# EAGLE design WebServer3 (EAGLE 6.1)
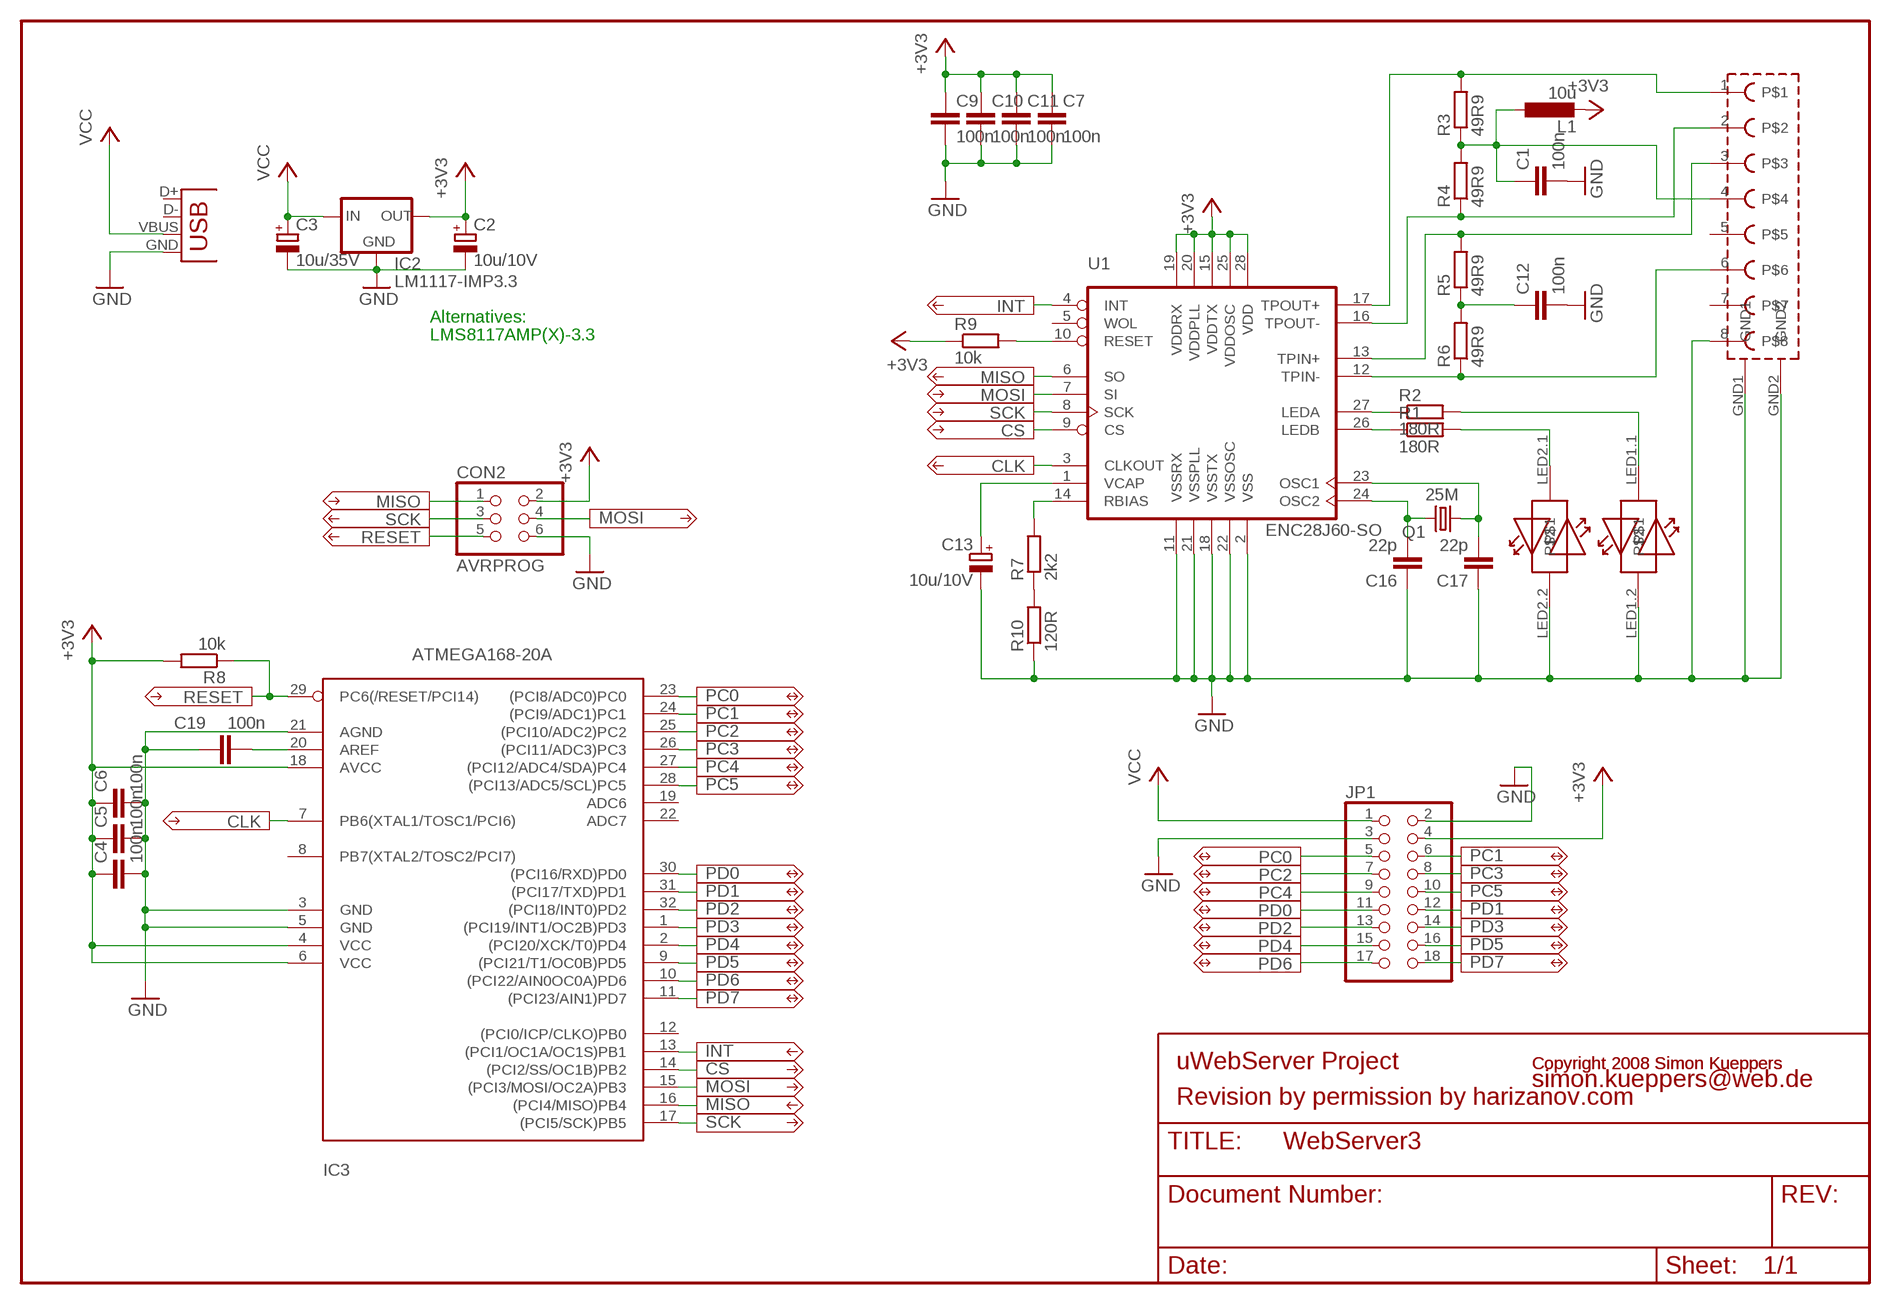
[diagram p0: schematic, sheet 1]

## Parts
C1  100n  C-EUC0805  [C0805]
C2  10u/10V  CPOL-EUSMCA  [SMC_A]
C3  10u/35V  CPOL-EUSMCC  [SMC_C]
C4  100n  C-EUC0805  [C0805]
C5  100n  C-EUC0805  [C0805]
C6  100n  C-EUC0805  [C0805]
C7  100n  C-EUC0805  [C0805]
C9  100n  C-EUC0805  [C0805]
C10  100n  C-EUC0805  [C0805]
C11  100n  C-EUC0805  [C0805]
C12  100n  C-EUC0805  [C0805]
C13  10u/10V  CPOL-EUSMCA  [SMC_A]
C16  22p  C-EUC0805  [C0805]
C17  22p  C-EUC0805  [C0805]
C19  100n  C-EUC0805  [C0805]
CON2  AVRPROG  PINHD-2X3_2.54  [2X03]
IC2  LM1117-IMP3.3  LM1117  [SOT223]
IC3  ATMEGA168-20A  [TQFP32-08]
JP1  PINHD-2X9  [2X09]
L1  10u  L-EU0207/10  [0207/10]
MAGJACK  MAGJACK  [MAGJACK]
Q1  25M  CRYSTALHC49UP  [HC49UP]
R1  180R  R-EU_R0805  [R0805]
R2  180R  R-EU_R0805  [R0805]
R3  49R9  R-EU_R0805  [R0805]
R4  49R9  R-EU_R0805  [R0805]
R5  49R9  R-EU_R0805  [R0805]
R6  49R9  R-EU_R0805  [R0805]
R7  2k2  R-EU_R0805  [R0805]
R8  10k  R-EU_R0805  [R0805]
R9  10k  R-EU_R0805  [R0805]
R10  120R  R-EU_R0805  [R0805]
U1  ENC28J60-SO  [SO28W]
X1  USB-MICROB  [USB-MICROB]

## Nets
+3V3: C2.+ C4.1 C5.1 C6.1 C7.1 C9.1 C10.1 C11.1 CON2.2 IC2.2(OUT) IC3.4(VCC) IC3.6(VCC) IC3.18(AVCC) JP1.4 L1.2 R8.2 R9.1 U1.15(VDDTX) U1.19(VDDRX) U1.20(VDDPLL) U1.25(VDDOSC) U1.28(VDD)
CLK: IC3.7(PB6(XTAL1/TOSC1/PCI6)) U1.3(CLKOUT)
CS: IC3.14((PCI2/SS/OC1B)PB2) U1.9(CS)
GND: C1.2 C2.- C3.- C4.2 C5.2 C6.2 C7.2 C9.2 C10.2 C11.2 C12.2 C13.- C16.1 C17.1 C19.1 CON2.6 IC2.1(GND) IC3.3(GND) IC3.5(GND) IC3.21(AGND) JP1.2 JP1.3 MAGJACK.8 MAGJACK.GND1 MAGJACK.GND2 MAGJACK.LED1.2 MAGJACK.LED2.2 R10.1 U1.2(VSS) U1.11(VSSRX) U1.18(VSSTX) U1.21(VSSPLL) U1.22(VSSOSC) X1.GND
INT: IC3.13((PCI1/OC1A/OC1S)PB1) U1.4(INT)
MISO: CON2.1 IC3.16((PCI4/MISO)PB4) U1.6(SO)
MOSI: CON2.4 IC3.15((PCI3/MOSI/OC2A)PB3) U1.7(SI)
N$1: R7.1 R10.2
N$9: C13.+ U1.1(VCAP)
N$10: R7.2 U1.14(RBIAS)
N$11: C17.2 Q1.1 U1.23(OSC1)
N$12: C16.2 Q1.2 U1.24(OSC2)
N$14: R2.1 U1.27(LEDA)
N$16: C19.2 IC3.20(AREF)
N$33: R1.1 U1.26(LEDB)
N$36: MAGJACK.LED1.1 R2.2
N$37: R9.2 U1.10(RESET)
N$39: MAGJACK.LED2.1 R1.2
N$40: C1.1 L1.1 MAGJACK.4 R3.1 R4.2
N$41: C12.1 R5.1 R6.2
N$42: MAGJACK.6 R6.1 U1.12(TPIN-)
N$43: MAGJACK.3 R5.2 U1.13(TPIN+)
N$44: MAGJACK.2 R4.1 U1.16(TPOUT-)
N$45: MAGJACK.1 R3.2 U1.17(TPOUT+)
PC0: IC3.23((PCI8/ADC0)PC0) JP1.5
PC1: IC3.24((PCI9/ADC1)PC1) JP1.6
PC2: IC3.25((PCI10/ADC2)PC2) JP1.7
PC3: IC3.26((PCI11/ADC3)PC3) JP1.8
PC4: IC3.27((PCI12/ADC4/SDA)PC4) JP1.9
PC5: IC3.28((PCI13/ADC5/SCL)PC5) JP1.10
PD0: IC3.30((PCI16/RXD)PD0) JP1.11
PD1: IC3.31((PCI17/TXD)PD1) JP1.12
PD2: IC3.32((PCI18/INT0)PD2) JP1.13
PD3: IC3.1((PCI19/INT1/OC2B)PD3) JP1.14
PD4: IC3.2((PCI20/XCK/T0)PD4) JP1.15
PD5: IC3.9((PCI21/T1/OC0B)PD5) JP1.16
PD6: IC3.10((PCI22/AIN0OC0A)PD6) JP1.17
PD7: IC3.11((PCI23/AIN1)PD7) JP1.18
RESET: CON2.5 IC3.29(PC6(/RESET/PCI14)) R8.1
SCK: CON2.3 IC3.17((PCI5/SCK)PB5) U1.8(SCK)
VCC: C3.+ IC2.3(IN) JP1.1 X1.VBUS
Unconnected: IC3.8(PB7(XTAL2/TOSC2/PCI7)) IC3.12((PCI0/ICP/CLKO)PB0) IC3.19(ADC6) IC3.22(ADC7) MAGJACK.5 MAGJACK.7 U1.5(WOL) X1.D+ X1.D-

## Notes on the sheet
- Alternatives:
- LMS8117AMP(X)-3.3
- uWebServer Project | Copyright 2008 Simon Kueppers | Copyright 2008 Simon Kueppers
- simon.kueppers@web.de
- Revision by permission by harizanov.com

## Library data of the parts
C1 C4-C7 C9-C12 C16 C17 C19 = rcl:C-EU: CAPACITOR, European symbol
C2 C3 C13 = rcl:CPOL-EU: POLARIZED CAPACITOR, European symbol
CON2 = pinhead:PINHD-2X3: PIN HEADER
IC2 = v-reg-2:LM1117
IC3 = avr:ATMEGA168: MICROCONTROLLER 16 kBytes FLASH 1 kBytes SRAM 512 Bytes EEPROM USART 8-channel 10 bit ADC
JP1 = pinhead:PINHD-2X9: PIN HEADER
L1 = rcl:L-EU: INDUCTOR, European symbol
MAGJACK = magjacksmalldrill:MAGJACK
Q1 = crystal:CRYSTAL: CRYSTAL
R1-R10 = rcl:R-EU_: RESISTOR, European symbol
U1 = microchip-enc28j60:ENC28J60-*: Microchip 10Mbit Eth. contoller with SPI interface
X1 = SparkFun:USB: USB Connectors USB-B-PTH is fully proven SKU : PRT-00139 USB-miniB is fully proven SKU : PRT-00587 USB-A-PCB is untested. USB-A-H is throughly reviewed, but untested. Spark Fun Electronics SKU : PRT-00437 USB-B-SMT is throughly reviewed, but untested. Needs silkscreen touching up. USB-A-S has not been used/tested USB-MB-H has not been used/tested

## Board
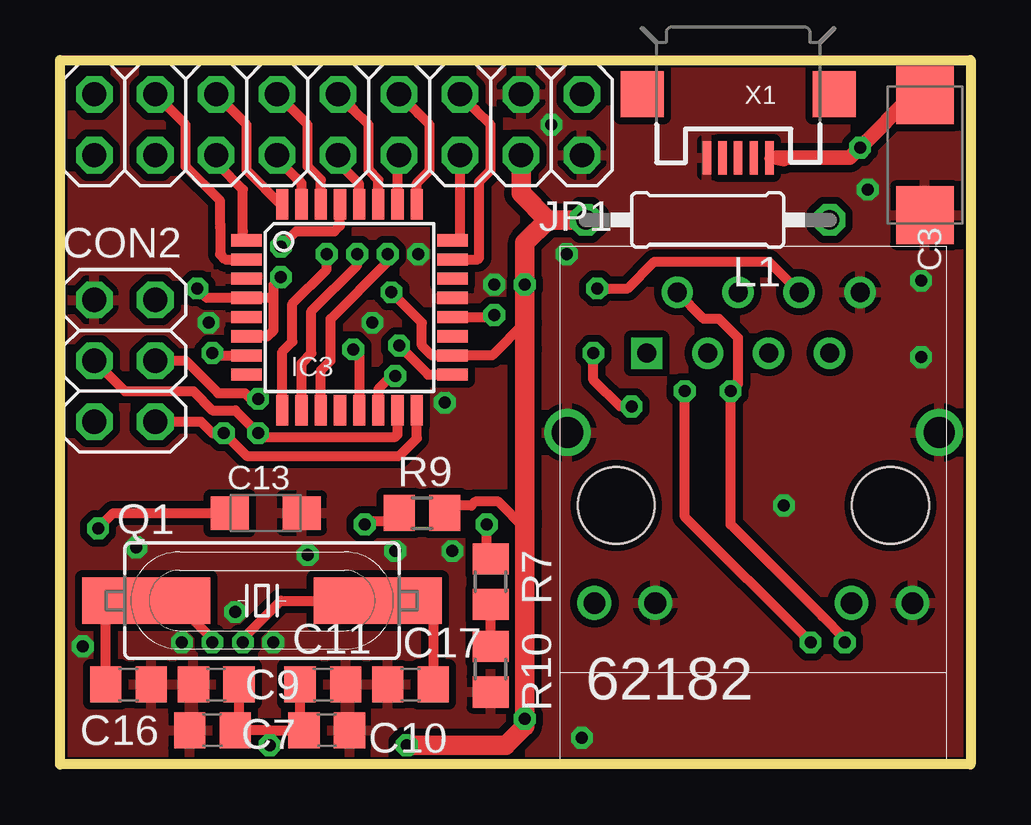
[diagram p1: board, top side]
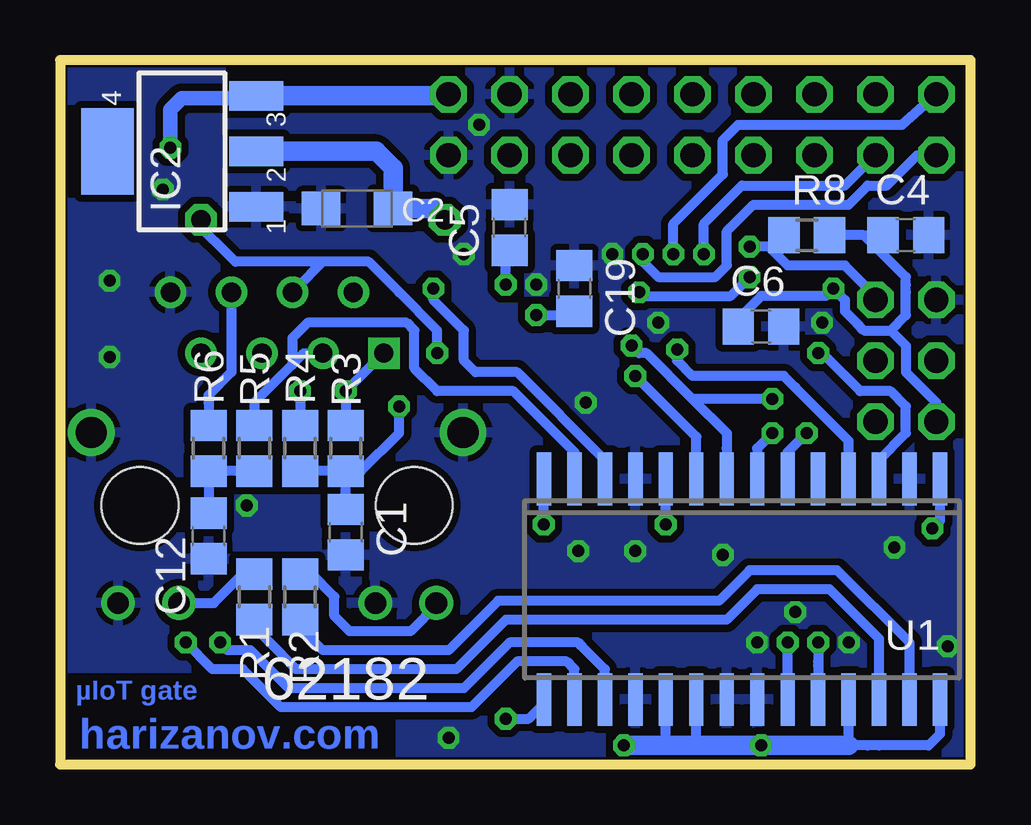
[diagram p2: board, bottom side, seen from below]

Size 37.94 x 29.37 mm. Coordinates in mm from the lower left corner, seen from the top.
Outline: 0,0 0,29.37 37.94,29.37 37.94,0 0,0
Copper layers (1*16): Top 0.035mm / dielectric 1.5mm / Bottom 0.035mm
Design rules: minimum track width 10mil, minimum drill 0.5mm, track to track 10mil, track to pad 10mil, pad to pad 10mil, via to via 10mil, smd to smd 10mil, copper to edge 10mil, drill to drill 10mil, minimum pad ring 10mil, minimum via ring 8mil, stop-mask expansion 4mil, vias tented up to drill 0mil, thermal gap 10mil
Milling: 4 lines

### Footprints (pad centres in the part's own frame; a part is rotated, then mirrored left to right if it is on the bottom)
C0805 = smd 1.3 x 1.5: 1 -0.95,0; 2 0.95,0
SMC_A = smd 1.6 x 1.4: + -1.5,0; - 1.5,0
SMC_C = smd 2.4 x 2.4: + -2.5,0; - 2.5,0
2X03 = drill 1.016 octagon: 1 -2.54,-1.27; 2 -2.54,1.27; 3 0,-1.27; 4 0,1.27; 5 2.54,-1.27; 6 2.54,1.27
SOT223 = smd 1.219 x 2.235: 1 -2.311,-3.099; 2 0,-3.099; 3 2.311,-3.099 | smd 3.6 x 2.2: 4 0,3.099
TQFP32-08 = smd 1.27 x 0.508: 1 -4.293,2.8; 2 -4.293,2; 3 -4.293,1.2; 4 -4.293,0.4; 5 -4.293,-0.4; 6 -4.293,-1.2; 7 -4.293,-2; 8 -4.293,-2.8; 17 4.293,-2.8; 18 4.293,-2; 19 4.293,-1.2; 20 4.293,-0.4; 21 4.293,0.4; 22 4.293,1.2; 23 4.293,2; 24 4.293,2.8 | smd 0.508 x 1.27: 9 -2.8,-4.293; 10 -2,-4.293; 11 -1.2,-4.293; 12 -0.4,-4.293; 13 0.4,-4.293; 14 1.2,-4.293; 15 2,-4.293; 16 2.8,-4.293; 25 2.8,4.293; 26 2,4.293; 27 1.2,4.293; 28 0.4,4.293; 29 -0.4,4.293; 30 -1.2,4.293; 31 -2,4.293; 32 -2.8,4.293
2X09 = drill 1.016 octagon: 1 -10.16,-1.27; 2 -10.16,1.27; 3 -7.62,-1.27; 4 -7.62,1.27; 5 -5.08,-1.27; 6 -5.08,1.27; 7 -2.54,-1.27; 8 -2.54,1.27; 9 0,-1.27; 10 0,1.27; 11 2.54,-1.27; 12 2.54,1.27; 13 5.08,-1.27; 14 5.08,1.27; 15 7.62,-1.27; 16 7.62,1.27; 17 10.16,-1.27; 18 10.16,1.27
0207/10 = drill 0.813 octagon: 1 -5.08,0; 2 5.08,0
MAGJACK = drill 0.8 square: 1 -4.445,6.35 | drill 0.8: 2 -3.175,8.89; 3 -1.905,6.35; 4 -0.635,8.89; 5 0.635,6.35; 6 1.905,8.89; 7 3.175,6.35; 8 4.445,8.89 | drill 1.3: GND1 -7.747,3.048; GND2 7.747,3.048 | drill 0.9: LED1.1 -6.629,-4.064; LED1.2 -4.089,-4.064; LED2.1 4.089,-4.064; LED2.2 6.629,-4.064 | hole 3.2: -5.715,0; 5.715,0
HC49UP = smd 5.334 x 1.93: 1 -4.826,0; 2 4.826,0
R0805 = smd 1.3 x 1.5: 1 -0.95,0; 2 0.95,0
SO28W = smd 0.6 x 2.2: 1 -8.255,-4.6; 2 -6.985,-4.6; 3 -5.715,-4.6; 4 -4.445,-4.6; 5 -3.175,-4.6; 6 -1.905,-4.6; 7 -0.635,-4.6; 8 0.635,-4.6; 9 1.905,-4.6; 10 3.175,-4.6; 11 4.445,-4.6; 12 5.715,-4.6; 13 6.985,-4.6; 14 8.255,-4.6; 15 8.255,4.6; 16 6.985,4.6; 17 5.715,4.6; 18 4.445,4.6; 19 3.175,4.6; 20 1.905,4.6; 21 0.635,4.6; 22 -0.635,4.6; 23 -1.905,4.6; 24 -3.175,4.6; 25 -4.445,4.6; 26 -5.715,4.6; 27 -6.985,4.6; 28 -8.255,4.6
USB-MICROB = smd 0.35 x 1.4: D+ 0,2.65; D- -0.65,2.65; GND 1.3,2.65; ID 0.65,2.65; VBUS -1.3,2.65 | smd 1.8 x 1.9: MT1 -4,0; MT2 4,0

### Placement (x,y rotation side)
C1  26.04,9.68 270 bottom
C2  25.56,23.18 180 bottom
C3  36.04,25.4 270 top
C4  2.7,22.07 0 bottom
C5  19.21,22.38 90 bottom
C6  8.73,18.26 0 bottom
C7  6.35,1.43 180 top
C9  6.51,3.33 180 top
C10  11.11,1.43 0 top
C11  10.95,3.33 0 top
C12  31.75,9.53 270 bottom
C13  8.57,10.48 0 top
C16  2.86,3.33 180 top
C17  14.61,3.33 0 top
C19  16.51,19.84 270 bottom
CON2  2.7,16.83 90 top
IC2  32.86,25.56 90 bottom
IC3  12.06,19.05 0 top
JP1  11.59,26.67 180 top
L1  26.99,22.7 180 top
MAGJACK  28.89,10.79 0 top
Q1  8.41,6.83 180 top
R1  29.84,6.98 90 bottom
R2  27.94,6.98 90 bottom
R3  26.04,13.18 90 bottom
R4  27.94,13.18 270 bottom
R5  29.85,13.18 90 bottom
R6  31.75,13.18 270 bottom
R7  17.94,7.62 90 top
R8  6.83,22.07 0 bottom
R9  15.08,10.48 180 top
R10  17.94,3.97 90 top
U1  9.53,7.3 180 bottom
X1  28.26,27.94 180 top

### Tracks (layer width: path | path; a pad name or v marks a point on that pad's centre or on a via)
+3V3  (via drill 0.5)
  Top 0.406: 8.89,19.37 8.81,19.45 IC3.4 6.12,19.45 v5.71,19.84 | IC3.6 8.64,17.85 8.89,18.1 8.89,19.37 | 8.89,19.37 8.89,20 v9.21,20.32 | v13.81,19.68 15.08,18.41 15.08,17.46 15.49,17.05 IC3.18 18,17.05 19.37,18.41 | 1.43,14.76 1.43,14.77 CON2.2 | 19.21,9.84 19.37,10 19.37,9.84 | 19.37,9.84 19.37,10.48 19.37,11.75 | 19.37,9.84 18.26,10.95 17.3,10.95 17.14,10.79 16.03,10.79 R9.1 | 9.68,3.33 9.69,3.33 | 9.68,3.33 | 7.78,3.49 | 7.78,3.49 | v8.73,0.79 8.73,1.43 | 7.62,1.43 | 8.73,1.43 7.62,1.43 | 8.73,1.43 C10.1 10,1.43 | 8.73,1.43 | 7.62,1.43 7.78,1.59 | 7.46,1.43 C9.1 7.62,3.49 7.78,3.49 | 10,1.43 | 10,1.43 C11.1 9.84,3.33 | 9.84,3.33 | 9.68,3.33 9.84,3.33 | 7.46,1.43 | 7.46,1.43 C7.1 | 7.62,1.43 7.46,1.43 | 7.62,1.43 | 7.62,1.43
  Top 0.813: 18.57,0.79 19.37,1.59 v19.37,1.9 19.37,10 19.37,10.48 | 18.57,0.79 | v14.45,0.79 18.57,0.79 | 18.57,0.79 | 19.37,10.48 19.37,17.3 | 19.37,17.3 | 19.37,10.48 | L1.2 21.75,22.7 20.32,22.7 | 19.37,17.3 19.37,18.41 v19.37,20 19.37,21.75 20.32,22.7 | JP1.4 19.21,23.81 20.32,22.7
  Bottom 0.406: 1.27,2.86 U1.28 1.27,1.27 1.75,0.79 3.81,0.79 | U1.15 17.78,2.54 18.1,2.22 18.41,1.9 v19.37,1.9 | v9.21,20.32 10,19.53 13.65,19.53 v13.81,19.68 | CON2.2 1.43,14.76 1.43,15.08 2.7,16.35 2.7,17.46 3.33,18.1 | 12.7,1.11 U1.19 | U1.25 | 5.08,0.79 U1.25 | U1.25 | 5.08,0.79 | 3.81,0.79 5.08,0.79 | 5.4,0.79 | 5.08,0.79 5.4,0.79 | 12.7,1.11 13.02,0.79 | 11.43,0.79 11.43,1.11 | 11.43,1.11 U1.20 | 11.43,1.11 11.43,0.79 | 11.43,0.79 | 12.7,1.11 12.7,0.95 12.54,0.79 11.43,0.79 | 3.81,0.79 | 3.81,0.79 4.29,0.79 | 11.43,1.11 11.43,0.63 | 11.43,0.63 | 11.43,0.63 11.43,0.79 | 11.43,0.79 v8.73,0.79 | C6.1 9.68,18.58 8.73,19.53 6.19,19.53 6.03,19.53 v5.71,19.84 | 2.7,20.32 2.7,20 2.7,19.68 2.7,18.73 3.33,18.1 | v19.37,20 19.37,21.27 C5.1 | 3.33,18.1 4.45,18.1 4.76,18.41 5.24,18.89 5.24,19.37 v5.71,19.84 | 3.33,18.1 | v5.71,19.84 | 2.7,20.32 | 2.7,20.32 4.29,21.91 4.45,22.07 | R8.2 | R8.2 | 4.45,22.07 R8.2 | 4.45,22.07 C4.1
  Bottom 0.813: 5.08,0.79 5.4,0.79 11.43,0.79 v14.45,0.79 | L1.2 22.38,23.18 C2.+ 24.06,24.85 24.77,25.56 IC2.2 | IC2.2
CLK  (via drill 0.5)
  Top 0.406: IC3.7 6.41,17.05 v6.35,17.14
  Bottom 0.406: U1.3 3.81,12.7 2.7,13.81 2.7,14.92 3.33,15.56 4.6,15.56 6.19,17.14 v6.35,17.14
CS  (via drill 0.5)
  Top 0.406: v13.97,16.19 13.81,16.19 | 13.81,16.19 | 13.81,16.19 13.27,15.65 IC3.14
  Bottom 0.406: v13.97,16.19 11.43,13.65 U1.9 11.43,11.75
GND  (via drill 0.5)
  other vias: 6.19,18.41 14.92,21.27 3.17,9.05 16.03,15.08 10.32,8.73 8.89,5.08 0.95,4.92 5.08,5.08 13.97,8.89 13.02,18.42 7.3,6.35 18.1,20 21.11,21.27 33.66,23.97 35.88,20.16 30.16,10.79 20.48,26.67 16.35,8.89 35.88,16.99 21.75,1.11
  pour Top (isolate 0.305): 0,29.37 0,0 37.94,0 37.94,29.37
  pour Bottom (isolate 0.305): 0,0 0,29.37 38.1,29.53 37.94,0
INT  (via drill 0.5)
  Top 0.406: IC3.13 12.46,17.07 v12.22,17.3
  Bottom 0.406: 5.08,11.75 U1.4 5.08,13.33 5.08,13.49 5.56,13.97 7.3,15.72 7.78,16.19 11.59,16.19 12.22,16.83 v12.22,17.3 | v12.22,17.3 | v12.22,17.3
MISO  (via drill 0.5)
  Top 0.406: IC3.16 14.87,13.59 14.13,12.86 7.78,12.86 v6.83,13.81 6.35,13.81 5.87,14.29 CON2.1
  Bottom 0.406: v6.83,13.81 7.62,13.02 U1.6 7.62,11.75
MOSI  (via drill 0.5)
  Top 0.406: IC3.15 14.06,13.75 13.97,13.65 8.41,13.65 v8.26,13.81 8.1,13.97 | 8.1,13.97 7.3,14.76 6.35,14.76 5.56,15.56 2.7,15.56 CON2.4 | 8.1,13.97
  Bottom 0.406: v8.26,13.81 8.89,13.18 U1.7
N$1
  Top 0.406: R10.2 | R10.2 R7.1 | R10.2
N$9  (via drill 0.5)
  Top 0.406: v1.59,9.84 1.75,10 2.22,10.48 5.71,10.48 C13.+
  Bottom 0.406: 1.27,12.06 U1.1 1.27,10.16 v1.59,9.84
N$10  (via drill 0.5)
  Top 0.406: R7.2 | R7.2 | v17.78,10 17.78,8.73 R7.2
  Bottom 0.406: 17.78,12.06 U1.14 v17.78,10
N$11  (via drill 0.5)
  Top 0.406: C17.2 15.55,6.82 15.56,6.83 13.34,6.83 | 13.18,6.83 | Q1.1 13.18,6.83 | 13.34,6.83 13.18,6.83 | 13.34,6.83 | Q1.1 13.34,6.83 | 12.86,6.83 13.34,6.83 | 12.86,6.83 10.79,6.83 | v7.62,5.08 7.62,5.24 9.21,6.83 12.86,6.83 | 12.86,6.83 | 12.86,6.83 Q1.1
  Bottom 0.406: 7.62,2.54 U1.23 7.62,4.29 v7.62,5.08
N$12  (via drill 0.5)
  Top 0.406: 6.35,5.24 4.76,6.83 3.49,6.83 | 6.35,5.24 | 6.35,5.24 v6.35,5.08 | 3.49,6.83 | 3.49,6.83 Q1.2 | C16.2 1.91,6.82 2.54,6.83 3.49,6.83
  Bottom 0.406: 6.35,2.54 U1.24 6.35,4.13 6.35,4.29 v6.35,5.08
N$14
  Bottom 0.406: U1.27 2.54,5.08 5.56,8.1 9.21,8.1 10.48,6.83 18.57,6.83 19.68,6.83 21.75,4.76 26.99,4.76 27.62,5.4 27.62,5.87 R2.1
N$16  (via drill 0.5)
  Top 0.406: IC3.20 18.02,18.65 v18.1,18.73
  Bottom 0.406: 16.51,18.73 | 16.51,18.73 C19.2 | v18.1,18.73 16.51,18.73
N$33
  Bottom 0.406: U1.26 3.81,5.24 5.87,7.3 8.89,7.3 10.16,6.03 19.37,6.03 21.43,3.97 28.1,3.97 29.21,5.08 29.84,5.71 R1.1
N$36
  Bottom 0.305: MAGJACK.LED1.1 22.26,6.71
  Bottom 0.406: R2.2 27.46,7.93 26.51,6.98 26.51,6.19 25.88,5.56 23.34,5.56 22.23,6.67 22.26,6.71
N$37  (via drill 0.5)
  Top 0.406: R9.2 14.13,10.16 13.97,10.16 12.86,10.16 v12.7,10 | v12.7,10
  Bottom 0.406: U1.10 v12.7,10
N$39
  Bottom 0.406: R1.2 30.16,7.93 30.32,7.94 31.53,6.73 MAGJACK.LED2.1
N$40  (via drill 0.5)
  Top 0.406: v23.81,14.92 23.34,14.92 22.23,16.03 v22.23,17.14
  Bottom 0.406: R3.1 R4.2 | R4.2 | R4.2 | R3.1 | C1.1 R3.1 | 25.72,12.23 25.72,12.22 | R3.1 25.72,12.23 | 25.72,12.23 25.4,12.22 23.81,13.81 v23.81,14.92 | R3.1 25.72,12.23 | v22.23,17.14 22.23,18.1 23.81,19.68 25.08,20.95 26.99,20.95 | L1.1 32.38,22.7 30.64,20.95 27.46,20.95 | 27.46,20.95 26.99,20.95 | 26.99,20.95 27.46,20.95 | MAGJACK.4 28.1,19.84 26.99,20.95
N$41
  Bottom 0.406: R5.1 R6.2 | C12.1 | R6.2 | R6.2 C12.1
N$42  (via drill 0.5)
  Top 0.406: v22.38,19.84 23.65,19.84 24.77,20.95 25.08,20.95 29.53,20.95 MAGJACK.6
  Bottom 0.406: 31.75,15.08 R6.1 | U1.12 15.24,12.7 18.89,16.35 20.64,16.35 21.11,16.83 21.11,18.1 22.38,19.37 22.38,19.68 v22.38,19.84 | MAGJACK.6 30.8,18.89 30.8,18.57 30.8,16.35 31.75,15.4 31.75,15.24 | 31.75,15.24 31.75,15.08 | 31.75,15.24 31.75,15.08
N$43
  Bottom 0.406: R5.2 29.84,15.08 28.26,16.67 | 28.26,17.78 28.26,16.67 | U1.13 16.51,13.02 19.05,15.56 22.23,15.56 23.18,16.51 23.18,18.1 23.5,18.41 27.62,18.41 28.26,17.78 | 28.26,17.78 | 28.26,16.67 27.78,17.14 27.15,17.14 | 27.15,17.14 | 27.15,17.14 MAGJACK.3 27.15,17.14
N$44  (via drill 0.5)
  Top 0.406: v32.7,5.08 32.7,5.24 31.75,6.19 | 31.75,6.19 | 31.75,6.19 27.94,10 v27.94,15.56 28.26,15.87 28.26,17.78 27.46,18.57 26.83,18.57 MAGJACK.2 | MAGJACK.2
  Bottom 0.406: U1.16 16.51,3.97 16.83,4.29 18.89,4.29 | v27.94,15.56 | 21.27,2.38 | 18.89,4.29 | 18.89,4.29 20.8,2.38 21.27,2.38 | 21.27,2.38 28.73,2.38 30.32,3.97 31.59,3.97 v32.7,5.08 | v27.94,15.56 R4.1 | v27.94,15.56
N$45  (via drill 0.5)
  Top 0.406: v31.27,5.08 26.04,10.32 v26.04,15.56
  Bottom 0.406: 26.04,13.81 R3.2 v26.04,15.56 | 15.24,2.54 U1.17 15.24,3.97 16.19,4.92 16.35,5.08 19.21,5.08 21.11,3.17 28.42,3.17 30,4.76 30.96,4.76 v31.27,5.08 | MAGJACK.1 | v26.04,15.56 | v26.04,15.56 MAGJACK.1
PC0
  Top 0.406: IC3.23 17.4,21.05 17.46,21.11 17.46,24.29 17.94,24.76 17.94,26.67 17.3,27.3 JP1.5
PC1
  Top 0.406: IC3.24 16.61,21.85 16.67,21.91 JP1.6 | JP1.6
PC2
  Top 0.406: IC3.25 14.87,24.23 15.4,24.76 15.4,26.67 14.92,27.15 JP1.7
PC3
  Top 0.406: IC3.26 14.06,25.34 | 14.06,25.34 | 14.06,25.34 JP1.8
PC4
  Top 0.406: IC3.27 13.27,24.36 12.86,24.76 12.86,26.67 12.22,27.3 12.06,27.46 JP1.9
PC5
  Top 0.406: IC3.28 12.46,24.21 11.59,25.08 | JP1.10 11.59,25.08 | 11.59,25.08
PD0
  Top 0.406: IC3.30 10.87,24.38 10.32,24.92 | 10.32,24.92 | 10.32,24.92 10.32,26.67 9.37,27.62 JP1.11
PD1
  Top 0.406: 9.13,25.16 9.84,24.45 10,24.29 10.06,24.22 IC3.31 | 9.13,25.16 9.05,25.24 | JP1.12 9.05,25.24 | 9.05,25.24 9.13,25.16
PD2
  Top 0.406: IC3.32 9.27,23.28 7.78,24.76 7.78,26.67 6.59,27.86 | 6.59,27.86 JP1.13 | JP1.13 | JP1.13 | JP1.13 6.59,27.86
PD3
  Top 0.406: 6.59,25 7.62,23.97 7.62,22.22 7.62,21.91 | 6.59,25 6.51,25.08 | 7.62,21.91 7.68,21.85 IC3.1 | 7.62,21.91 | 6.51,25.08 JP1.14 6.51,25.08 | 6.51,25.08 6.59,25
PD4
  Top 0.406: IC3.2 6.89,21.05 6.67,21.27 6.67,22.38 | 6.67,22.38 | 6.67,22.38 6.67,22.54 6.67,23.49 5.24,24.92 5.24,26.67 | 5.24,26.67 | 5.24,26.67 4.45,27.46 JP1.15
PD5  (via drill 0.5)
  Top 0.406: IC3.9 9.27,17.2 9.68,17.62 9.68,19.21 11.11,20.64 v11.11,21.27
  Bottom 0.406: v11.11,21.27 11.11,22.54 9.53,24.13 6.03,24.13 5.24,24.13 | 5.24,24.13 | 5.24,24.13 JP1.16
PD6  (via drill 0.5)
  Top 0.406: IC3.10 10.06,16.73 10.48,17.14 10.48,18.89 12.38,20.8 v12.38,21.27
  Bottom 0.406: 1.59,27.78 2.86,26.67 9.68,26.67 10.32,26.03 10.32,24.61 12.38,22.54 v12.38,21.27 | 1.59,27.78 | 1.59,27.78 | 1.59,27.78 JP1.17
PD7  (via drill 0.5)
  Top 0.406: v13.65,21.27 13.65,20.95 11.27,18.57 11.27,16.83 10.87,16.42 IC3.11
  Bottom 0.406: v13.65,21.27 13.65,20.95 13.02,20.32 10.64,20.32 10.16,20.8 10.16,22.22 9.05,23.34 5.56,23.34 5.08,23.34 4.29,24.13 3.49,24.13 2.54,25.08 2.22,25.4 JP1.18 | JP1.18
RESET  (via drill 0.5)
  Top 0.406: IC3.29 11.66,22.46 11.43,22.22 9.84,22.22 v9.21,21.59
  Bottom 0.406: v9.21,21.59 8.41,21.59 8.1,21.27 | 4.45,20 5.24,20.8 7.62,20.8 8.1,21.27 | 8.1,21.27 | R8.1 7.78,21.59 8.1,21.27 | CON2.5 3.97,19.53 4.45,20 | 4.45,20
SCK  (via drill 0.5)
  Top 0.406: IC3.17 15.34,16.25 v14.13,17.46 | v8.26,15.24 7.94,15.24 7.7,15.48 6.59,15.48 5.24,16.83 CON2.3
  Bottom 0.406: v14.13,17.46 13.81,17.14 13.49,17.14 11.59,15.24 | v8.26,15.24 | 10.16,13.18 U1.8 | 10.16,13.18 | v8.26,15.24 | 10.16,13.81 10.16,13.18 | 11.59,15.24 10.16,13.81 | 10.16,13.81 | v8.26,15.24 11.59,15.24 | 11.59,15.24
VCC  (via drill 0.5)
  Top 0.254: X1.VBUS 29.84,25.29 29.84,25.24
  Top 0.406: 30.16,25.24 29.56,25.24 X1.VBUS
  Top 0.61: C3.+ 35.52,27.9 v33.34,25.72 32.91,25.29 29.84,25.29 30.16,25.24
  Bottom 0.406: 21.82,27.87 JP1.1
  Bottom 0.61: v33.34,25.72 33.34,27.3 32.86,27.78 29.85,27.78 IC2.3
  Bottom 0.813: IC2.3 21.82,27.87

### Text on the board
Bottom: µIoT gate | harizanov.com
tPlace: 62182
bPlace: 62182